# EAGLE design Analog_amplifer_2 (EAGLE 9.6.2)

## Sheet 1 of 2
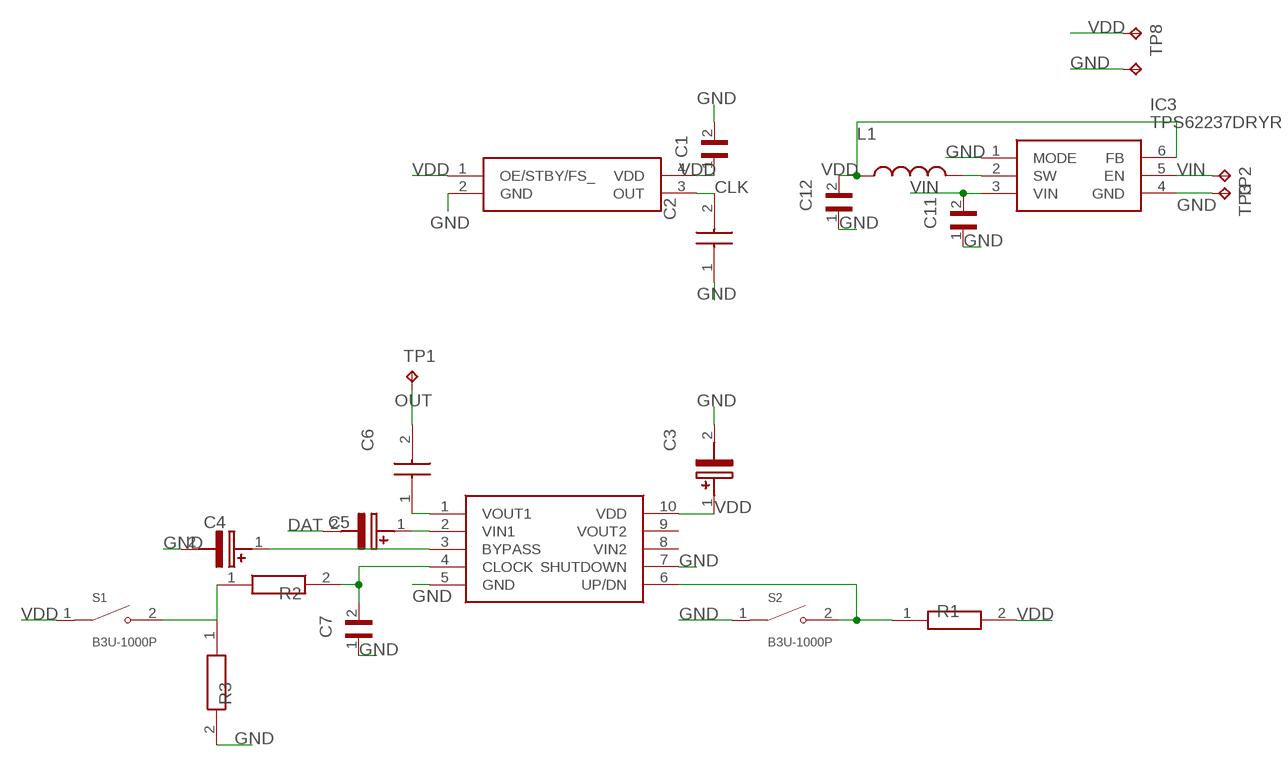
[diagram p0: schematic, sheet 1]

### Parts
C1  GRM033C80J104KE15D  [CAPC0603X33N]
C2  GRM0115C1E5R0CE01L  [CAPC0201X14N]
C3  F380J105MUA  [CAPPC1106X60N]
C4  F380J105MUA  [CAPPC1106X60N]
C5  F380J105MUA  [CAPPC1106X60N]
C6  GRM21BR60J107ME15L  [CAPC2012X145N]
C7  GRM033C80J104KE15D  [CAPC0603X33N]
C11  GRM155R60J225KE95D  [CAPC1005X55N]
C12  GRM155R60J475ME47D  [CAPC1005X60N]
IC1  LM4811MM_NOPB  [SOP50P490X110-10N]
IC3  TPS62237DRYR  [SON50P100X145X60-6N]
L1  LQM21PN2R2MC0D  [INDC2012X55N]
R1  RC0201FR-074K02L  [RESC0603X26N]
R2  RC0201FR-07100RL  [RESC0603X26N]
R3  RC0201FR-07100RL  [RESC0603X26N]
S1  B3U-1000P  [SW_B3U-1000P]
S2  B3U-1000P  [SW_B3U-1000P]
TP1  TPTP11R  [TP11R]
TP2  TPTP11R  [TP11R]
TP3  TPTP11R  [TP11R]
TP4  TPTP11R  [TP11R]
TP8  TPTP11R  [TP11R]
Y1  DSC6053CE2A-003.0720  [DSC6053CE2A0030720]

### Nets
CLK: C2.2 Y1.3(OUT) ; also sheet 2
DAT: C5.2(-) ; also sheet 2
GND: C1.2 C2.1 C3.2(-) C4.2(-) C7.1 C11.1 C12.1 IC1.5(GND) IC1.7(SHUTDOWN) IC3.1(MODE) IC3.4(GND) R3.2 S2.1 TP3.TP TP4.TP Y1.2(GND) ; also sheet 2
N$1: C4.1(+) IC1.3(BYPASS)
N$2: IC3.2(SW) L1.2
N$3: C6.1 IC1.1(VOUT1)
N$4: C7.2 IC1.4(CLOCK) R2.2
N$5: C5.1(+) IC1.2(VIN1)
N$6: IC1.6(UP/DN) R1.1 S2.2
N$7: R2.1 R3.1 S1.2
OUT: C6.2 TP1.TP
VDD: C1.1 C3.1(+) C12.2 IC1.10(VDD) IC3.6(FB) L1.1 R1.2 S1.1 TP8.TP Y1.1(OE/STBY/FS_) Y1.4(VDD) ; also sheet 2
VIN: C11.2 IC3.3(VIN) IC3.5(EN) TP2.TP
Unconnected: IC1.8(VIN2) IC1.9(VOUT2)

## Sheet 2 of 2
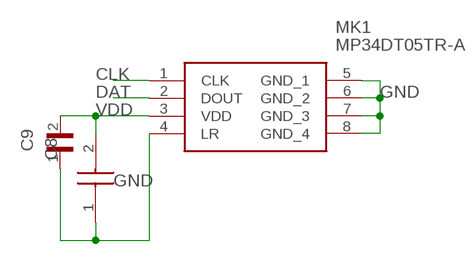
[diagram p1: schematic, sheet 2]

### Parts
C8  C0402C105K9PACTU  [CAPC1005X55N]
C9  GRM033C80J104KE15D  [CAPC0603X33N]
MK1  MP34DT05TR-A  [MP34DT05TRA]

### Nets
CLK: MK1.1(CLK) ; also sheet 1
DAT: MK1.2(DOUT) ; also sheet 1
GND: C8.1 C9.1 MK1.4(LR) MK1.5(GND_1) MK1.6(GND_2) MK1.7(GND_3) MK1.8(GND_4) ; also sheet 1
VDD: C8.2 C9.2 MK1.3(VDD) ; also sheet 1

## Library data of the parts
C1 C7 C9 = GRM033C80J104KE15D:GRM033C80J104KE15D: .1UF 6.3V 10% 0201; DESCRIPTION: SMD Capacitor X6S(EIA) with Capacitance: 0.10uF Tol. 10%. Rated Voltage: 6.3Vdc; DIGI-KEY_PART_NUMBER: 490-10390-1-ND; DIGIKEY-PURCHASE-URL: https://snapeda.com/shop?store=DigiKey&id=1836969; MF: Murata Electronics; MP: GRM033C80J104KE15D; PACKAGE: 0603 Taiyo Yuden
C2 = GRM0115C1E5R0CE01L:GRM0115C1E5R0CE01L: Capacitor GRM01 L=0.25mm W=0.125mm T=0.125mm Source: Datasheet <https://psearch.en.murata.com/capacitor/product/GRM0115C1E5R0CE01#.html>; ARROW_PART_NUMBER: GRM0115C1E5R0CE01L; DESCRIPTION: Capacitor GRM01 L=0.25mm W=0.125mm T=0.125mm; HEIGHT: 0.138mm; MANUFACTURER_NAME: Murata Electronics; MANUFACTURER_PART_NUMBER: GRM0115C1E5R0CE01L; MOUSER_PART_NUMBER: 81-GRM0115C1E5RCE01L; MOUSER_PRICE-STOCK: https://www.mouser.com/Search/Refine.aspx?Keyword=81-GRM0115C1E5RCE01L
C3-C5 = F380J105MUA:F380J105MUA: Tantalum Capacitors - Polymer SMD 1uF, 6.3VDC, 20% TOL 1500mOhm,0402 Source: Datasheet <https://eu.mouser.com/datasheet/2/40/f38-775706.pdf>; ARROW_PART_NUMBER: F380J105MUA; ARROW_PRICE-STOCK: https://www.arrow.com/en/products/f380j105mua/avx; DESCRIPTION: Tantalum Capacitors - Polymer SMD 1uF, 6.3VDC, 20% TOL 1500mOhm,0402; HEIGHT: 0.6mm; MANUFACTURER_NAME: AVX; MANUFACTURER_PART_NUMBER: F380J105MUA; MOUSER_PART_NUMBER: 581-F380J105MUA; MOUSER_PRICE-STOCK: https://www.mouser.com/Search/Refine.aspx?Keyword=581-F380J105MUA
C6 = GRM21BR60J107ME15L:GRM21BR60J107ME15L: Multilayer Ceramic Capacitors MLCC - SMD/SMT 100UF 6.3V 20% 0805 Source: Datasheet <https://psearch.en.murata.com/capacitor/product/GRM21BR60J107ME15#.html>; ARROW_PART_NUMBER: GRM21BR60J107ME15L; ARROW_PRICE-STOCK: https://www.arrow.com/en/products/grm21br60j107me15l/murata-manufacturing; DESCRIPTION: Multilayer Ceramic Capacitors MLCC - SMD/SMT 100UF 6.3V 20% 0805; HEIGHT: 1.45mm; MANUFACTURER_NAME: Murata Electronics; MANUFACTURER_PART_NUMBER: GRM21BR60J107ME15L; MOUSER_PART_NUMBER: 81-GRM21BR60J107ME5L; MOUSER_PRICE-STOCK: https://www.mouser.co.uk/ProductDetail/Murata-Electronics/GRM21BR60J107ME15L?qs=qSv5qXjCIG0V4cgMTBuIkA%3D%3D
C8 = C0402C105K9PACTU:C0402C105K9PACTU: 0402 X5R ceramic capacitor, 6.3V 1uF Kemet 0402 C 1uF Ceramic Multilayer Capacitor, 6.3 V dc, +85C, X5R Dielectric, +/-10% Source: Datasheet <https://content.kemet.com/datasheets/KEM_C1002_X7R_SMD.pdf>; ARROW_PART_NUMBER: C0402C105K9PACTU; ARROW_PRICE-STOCK: https://www.arrow.com/en/products/c0402c105k9pactu/kemet-corporation; DESCRIPTION: 0402 X5R ceramic capacitor, 6.3V 1uF Kemet 0402 C 1uF Ceramic Multilayer Capacitor, 6.3 V dc, +85C, X5R Dielectric, +/-10%; HEIGHT: 0.55mm; MANUFACTURER_NAME: Kemet; MANUFACTURER_PART_NUMBER: C0402C105K9PACTU; MOUSER_PART_NUMBER: 80-C0402C105K9P; MOUSER_PRICE-STOCK: https://www.mouser.co.uk/ProductDetail/KEMET/C0402C105K9PACTU?qs=UdQET6xYxVCMExqTDkuPeQ%3D%3D
C11 = GRM155R60J225KE95D:GRM155R60J225KE95D: CAP CER 2.2UF 6.3V X5R 0402; DESCRIPTION: 2.2µF ±10% 6.3V Ceramic Capacitor X5R 0402 (1005 Metric); DIGI-KEY_PART_NUMBER: 490-12532-1-ND; MF: Murata; MP: GRM155R60J225KE95D; PACKAGE: 1005 Taiyo Yuden
C12 = GRM155R60J475ME47D:GRM155R60J475ME47D: Cap Ceramic 4.7uF 6.3V X5R 20% Pad SMD 0402 85°C T/R; DESCRIPTION: SMD Capacitor X5R(EIA) with Capacitance: 4.7uF Tol. 20%. Rated Voltage: 6.3Vdc; DIGI-KEY_PART_NUMBER: 490-5915-1-ND; MF: Murata; MP: GRM155R60J475ME47D; PACKAGE: 1005 Taiyo Yuden
IC1 = LM4811MM_NOPB:LM4811MM_NOPB: LM4811 Dual 105mW Headphone Amplifier with Digital Volume Control and Shutdown Mode Source: Datasheet <http://www.ti.com/lit/ds/symlink/lm4811.pdf>; ARROW_PART_NUMBER: LM4811MM/NOPB; ARROW_PRICE-STOCK: https://www.arrow.com/en/products/lm4811mmnopb/texas-instruments; DESCRIPTION: LM4811 Dual 105mW Headphone Amplifier with Digital Volume Control and Shutdown Mode; HEIGHT: 1.1mm; MANUFACTURER_NAME: Texas Instruments; MANUFACTURER_PART_NUMBER: LM4811MM/NOPB; MOUSER_PART_NUMBER: 926-LM4811MM/NOPB; MOUSER_PRICE-STOCK: https://www.mouser.co.uk/ProductDetail/Texas-Instruments/LM4811MM-NOPB?qs=QbsRYf82W3FLuQL5YsjYUw%3D%3D
IC3 = TPS62237DRYR:TPS62237DRYR: 2 MHz Ultra Small Step Down Converter with DCS-Control in 1x1.5 SON Package Source: Datasheet <http://www.ti.com/lit/gpn/TPS62230>; ARROW_PART_NUMBER: TPS62237DRYR; ARROW_PRICE-STOCK: https://www.arrow.com/en/products/tps62237dryr/texas-instruments; DESCRIPTION: 2 MHz Ultra Small Step Down Converter with DCS-Control in 1x1.5 SON Package; HEIGHT: 0.6mm; MANUFACTURER_NAME: Texas Instruments; MANUFACTURER_PART_NUMBER: TPS62237DRYR; MOUSER_PART_NUMBER: 595-TPS62237DRYR; MOUSER_PRICE-STOCK: https://www.mouser.co.uk/ProductDetail/Texas-Instruments/TPS62237DRYR?qs=%2Fqzd9s%252BcLd6Amw0z%252Byi3sQ%3D%3D
L1 = LQM21PN2R2MC0D:LQM21PN2R2MC0D: INDUCTOR, 2.2UH, 20%, 0.6A, 50MHZ, 0805; DESCRIPTION: Inductor with Inductance: 2.2uH Tol. +/-20%, Package: 0805 (2012); DIGI-KEY_PART_NUMBER: 490-4994-1-ND; DIGIKEY-PURCHASE-URL: https://snapeda.com/shop?store=DigiKey&id=1501934; MF: Murata; MOUSER-PURCHASE-URL: https://snapeda.com/shop?store=Mouser&id=1501934; MP: LQM21PN2R2MC0D; PACKAGE: 2012 Murata
MK1 = MP34DT05TR-A:MP34DT05TR-A: STMICROELECTRONICS - MP34DT05TR-A - MEMS MICROPHONE, 3.6V, HCLGA-4 Source: Datasheet <http://www.st.com/content/ccc/resource/technical/document/datasheet/group3/c7/90/d3/f6/b7/e7/40/c8/DM00415595/files/DM00415595.pdf/jcr:content/translations/en.DM00415595.pdf>; DESCRIPTION: STMICROELECTRONICS - MP34DT05TR-A - MEMS MICROPHONE, 3.6V, HCLGA-4; HEIGHT: 1mm; MANUFACTURER_NAME: STMicroelectronics; MANUFACTURER_PART_NUMBER: MP34DT05TR-A; MOUSER_PART_NUMBER: 511-MP34DT05TR-A; MOUSER_PRICE-STOCK: https://www.mouser.com/Search/Refine.aspx?Keyword=511-MP34DT05TR-A
R1 = RC0201FR-074K02L:RC0201FR-074K02L: YAGEO RC0201 F Source: Datasheet <http://www.yageo.com/documents/recent/PYu-RC0201_51_RoHS_L_8.pdf>; ARROW_PART_NUMBER: RC0201FR-074K02L; DESCRIPTION: YAGEO RC0201 F; HEIGHT: 0.26mm; MANUFACTURER_NAME: YAGEO (PHYCOMP); MANUFACTURER_PART_NUMBER: RC0201FR-074K02L
R2 R3 = RC0201FR-07100RL:RC0201FR-07100RL: Thick Film Resistors - SMD 100 OHM 1% Source: Datasheet <http://www.yageo.com/documents/recent/PYu-RC0201_51_RoHS_L_8.pdf>; ARROW_PART_NUMBER: RC0201FR-07100RL; DESCRIPTION: Thick Film Resistors - SMD 100 OHM 1%; HEIGHT: 0.26mm; MANUFACTURER_NAME: YAGEO (PHYCOMP); MANUFACTURER_PART_NUMBER: RC0201FR-07100RL; MOUSER_PART_NUMBER: 603-RC0201FR-07100RL; MOUSER_PRICE-STOCK: https://www.mouser.com/Search/Refine.aspx?Keyword=603-RC0201FR-07100RL
S1 S2 = B3U-1000P:B3U-1000P: Switch Tactile N.O. SPST Round Button Gull Wing 0.05A 12VDC 1.5N SMD Embossed T/R; DESCRIPTION: Tactile Switch SPST-NO Top Actuated Surface Mount; DIGI-KEY_PART_NUMBER: SW1020CT-ND; DIGIKEY-PURCHASE-URL: https://snapeda.com/shop?store=DigiKey&id=104326; MF: Omron; MP: B3U-1000P; PACKAGE: None
TP1-TP4 TP8 = testpad:TP: Test pad
Y1 = DSC6053CE2A-003.0720:DSC6053CE2A-003.0720: Programmable Oscillators MEMS Oscillator, Ultra Low Power, LVCMOS, -20C-70C, 25ppm, 3.2x2.5mm Source: Datasheet; DESCRIPTION: Programmable Oscillators MEMS Oscillator, Ultra Low Power, LVCMOS, -20C-70C, 25ppm, 3.2x2.5mm; HEIGHT: 0.9mm; MANUFACTURER_NAME: Microchip; MANUFACTURER_PART_NUMBER: DSC6053CE2A-003.0720

## Board
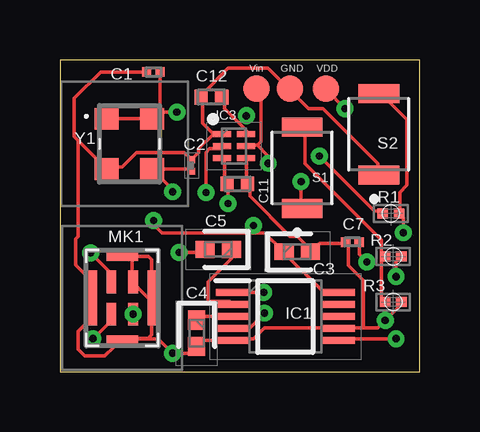
[diagram p2: board, top side]
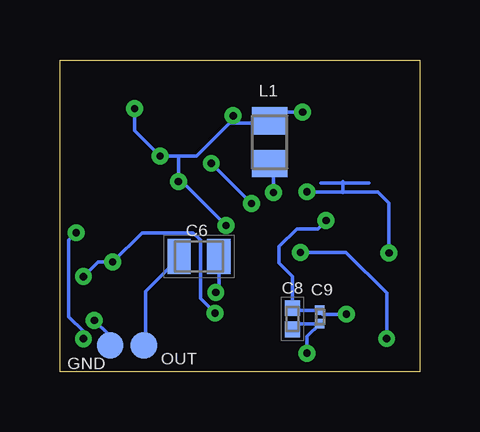
[diagram p3: board, bottom side, seen from below]

Size 15 x 13 mm. Coordinates in mm from the lower left corner, seen from the top.
Outline: 0,0 15,0 15,13 0,13 0,0
Copper layers (1*16): Top 0.035mm / dielectric 1.5mm / Bottom 0.035mm
Design rules "default *": minimum track width 6mil, minimum drill 0.3mm, track to track 6mil, track to pad 6mil, pad to pad 6mil, via to via 6mil, smd to smd 6mil, copper to edge 10mil, drill to drill 0.3mm, minimum pad ring 10mil, minimum via ring 8mil, stop-mask expansion 4mil, vias tented up to drill 0mil, thermal gap 10mil

### Footprints (pad centres in the part's own frame; a part is rotated, then mirrored left to right if it is on the bottom)
CAPC0603X33N = smd 0.38 x 0.4: 1 -0.281,0; 2 0.281,0
CAPC0201X14N = smd 0.29 x 0.26: 1 -0.245,0; 2 0.245,0
CAPPC1106X60N = smd 0.8 x 0.7: 1 -0.55,0; 2 0.55,0
CAPC2012X145N = smd 0.97 x 1.47: 1 -0.83,0; 2 0.83,0
CAPC1005X55N = smd 0.65 x 0.62: 1 -0.44,0; 2 0.44,0
CAPC1005X55N' = smd 0.54 x 0.6: 1 -0.432,0; 2 0.432,0
CAPC1005X60N = smd 0.56 x 0.63: 1 -0.435,0; 2 0.435,0
SOP50P490X110-10N = smd 1.4 x 0.3: 1 -2.2,1; 2 -2.2,0.5; 3 -2.2,0; 4 -2.2,-0.5; 5 -2.2,-1; 6 2.2,-1; 7 2.2,-0.5; 8 2.2,0; 9 2.2,0.5; 10 2.2,1
SON50P100X145X60-6N = smd 0.75 x 0.25: 1 -0.5,0.5; 2 -0.5,0; 3 -0.5,-0.5; 4 0.5,-0.5; 5 0.5,0; 6 0.5,0.5
INDC2012X55N = smd 1.14 x 1.47: 1 -0.89,0; 2 0.89,0
MP34DT05TRA = smd 0.4 x 0.95: 1 -0.45,0.675; 2 -0.45,-0.675; 3 0.45,-0.675; 4 0.45,0.675 | smd 0.35 x 2.3: 5 -1.225,0; 6 1.225,0 | smd 1.3 x 0.35: 7 0,1.725; 8 0,-1.725
RESC0603X26N = smd 0.44 x 0.42: 1 -0.34,0; 2 0.34,0
SW_B3U-1000P = smd 0.8 x 1.7: 1 -1.7,0; 2 1.7,0
TP11R = smd 1.1 x 1.1: TP 0,0
DSC6053CE2A0030720 = smd 1 x 0.9: 1 -0.95,1.05; 2 -0.95,-1.05; 3 0.95,-1.05; 4 0.95,1.05

### Placement (x,y rotation side)
C1  3.9,12.5 180 top
C2  5.5,8.6 270 top
C3  9.9,5 0 top
C4  5.7,1.6 270 top
C5  6.6,5.1 180 top
C6  9.2,4.8 180 bottom
C7  12.2,5.4 0 top
C8  5.3,2.2 90 bottom
C9  4.16,2.28 90 bottom
C11  GRM155R60J225KE95D  [CAPC1005X55N']  7.4,7.84 180 top
C12  6.32,11.45 0 top
IC1  9.4,2.3 0 top
IC3  7.25,9.41 0 top
L1  6.25,9.57 270 bottom
MK1  2.6,3.07 0 top
R1  13.8,6.6 180 top
R2  13.9,4.8 0 top
R3  13.9,2.9 0 top
S1  10.1,8.5 90 top
S2  13.3,9.9 90 top
TP1  11.5,1.1 0 bottom
TP2  8.2,11.8 0 top
TP3  12.9,1.1 0 bottom
TP4  9.6,11.8 0 top
TP8  11.1,11.8 0 top
Y1  2.9,9.5 0 top

### Tracks (layer width: path | path; a pad name or v marks a point on that pad's centre or on a via)
CLK  (via drill 0.3)
  Top 0.152: v1.27,4.95 2.12,4.1 2.12,3.75 MK1.1 | v4.7,7.5 4.7,7.6 Y1.3 5.41,8.45 C2.2
  Bottom 0.152: 2.12,7.88 3.2,7.88 | 3.2,7.88 4.12,7.88 | v1.27,4.95 1.27,7.03 1.75,7.5 3.2,7.5 | v4.7,7.5 3.2,7.5 | 3.2,7.5 3.2,7.88 | 3.2,7.92 3.2,7.88 | 3.2,7.47 3.2,7.5
DAT  (via drill 0.3)
  Top 0.152: v4.97,4.97 5.75,4.97 5.88,5.1 C5.2 | v1.38,1.38 2.12,2.12 2.12,2.38 MK1.2
  Bottom 0.152: v1.38,1.38 1.38,3.27 3.08,4.97 v4.97,4.97
GND  (via drill 0.3)
  Top 0.152: 7.75,7.92 C11.1 | MK1.4 3.12,3.62 3.75,3 MK1.6 | MK1.7 2.85,4.79 3,4.65 3,4.12 | 3,4.12 3,3.75 MK1.4 | MK1.7 2.6,4.76 2.53,4.72 | 3,4.12 MK1.4 | 2.62,4.88 MK1.7 | 7.75,7.78 C11.1 | 6.75,10.03 IC3.1 | 2.62,1.28 MK1.8 1.87,0.65 1.02,0.65 0.75,0.93 0.75,1.68 1.38,2.3 MK1.5 1.38,3.73 0.65,4.45 0.65,5.53 0.76,5.64 0.76,9.64 | 2.62,1.28 2.59,1.38 3.68,1.38 3.83,1.52 MK1.6 | 2.62,1.28 2.64,1.18 2.83,1.37 4.1,1.37 v4.7,0.77 5.79,0.77 5.49,1.07 5.64,1.07 | 5.95,11.45 C12.1 | C1.2 1.7,12.5 0.6,11.4 0.6,9.8 0.76,9.64 | 0.76,9.64 Y1.2 1.98,8.53 2.59,8.53 3.2,9.14 5.18,9.14 5.49,8.84 | 12.65,1.83 11.73,1.83 IC1.7 11.58,1.83 8.53,1.83 8.08,1.37 7.32,1.37 IC1.5 5.95,1.3 C4.2 5.64,1.07 | 12.65,1.83 13.26,1.83 v13.56,2.13 14.17,2.74 14.17,2.9 R3.2 | C11.1 7.77,7.92 7.77,8.84 IC3.4 | 10.52,5.03 10.82,5.33 11.89,5.33 C7.1 12.04,5.33 12.04,4.42 12.65,3.81 12.65,1.83 | 10.52,5.03 9.91,5.64 9.6,5.64 7.92,7.32 7.92,7.77 C11.1 | 10.52,5.03 C3.2 | 5.64,1.07 5.86,1.07 5.78,1.15 | 5.49,8.84 5.79,9.14 5.79,9.3 6.4,9.91 | 6.4,9.91 6.71,9.91 IC3.1 | 6.4,9.91 5.94,10.36 5.94,11.43 C12.1 | 6.4,9.91 IC3.1 | C12.1 5.94,11.58 7.01,12.65 8.69,12.65 9.45,11.89 TP4.TP 9.6,11.73 10.36,10.97 10.97,10.97 13.26,8.69 13.26,8.23 S2.1 | 5.49,8.84 C2.1 | MK1.7 3.71,4.79 3.83,4.67 MK1.6
  Bottom 0.152: 12.9,1.48 TP3.TP 12.95,1.52 v13.56,2.13 | C8.1 5.06,2 C9.1 4.7,1.46 v4.7,0.77
N$1
  Top 0.152: IC1.3 5.85,2.3 C4.1
N$2  (via drill 0.3)
  Top 0.152: 6.75,9.53 IC3.2 6.71,9.3 6.25,9.3 6.1,9.14 v6.1,7.47
  Bottom 0.152: v6.1,7.47 6.1,8.38 6.25,8.53 L1.2
N$3  (via drill 0.3)
  Top 0.152: IC1.1 v8.5,3.3
  Bottom 0.152: v8.5,3.3 8.37,3.43 C6.1
N$4  (via drill 0.3)
  Top 0.152: v12.8,4.57 12.5,4.88 12.5,5.33 C7.2 | v14.02,3.96 14.02,4.57 14.17,4.72 R2.2 | v8.53,2.44 7.92,1.83 7.32,1.83 IC1.4
  Bottom 0.152: v14.02,3.96 13.41,4.57 v12.8,4.57 11.58,5.79 9.45,5.79 9.14,5.49 9.14,3.05 v8.53,2.44
N$5
  Top 0.152: C5.1 7.15,4.72 6.17,3.75 6.17,2.96 6.21,2.92 7.08,2.92 IC1.2
N$6  (via drill 0.3)
  Top 0.152: S2.2 13.41,11.58 14.48,10.52 14.48,7.77 14.17,7.47 14.17,6.71 R1.1 14.17,6.55 14.33,6.4 v14.33,5.79 | v14.02,1.37 11.73,1.37 IC1.6
  Bottom 0.152: v14.02,1.37 14.02,1.68 14.63,2.29 14.63,5.49 v14.33,5.79
N$7
  Top 0.152: R3.1 13.41,3.05 13.41,4.72 R2.1 13.41,4.88 13.41,5.49 10.21,8.69 10.21,10.06 S1.2
OUT
  Bottom 0.152: TP1.TP 11.43,1.22 11.43,3.35 10.06,4.72 C6.2
VDD  (via drill 0.3)
  Top 0.152: 3.08,2.05 3.08,2.39 v3.05,2.4 | IC3.6 7.75,10.03 7.77,10.06 7.47,10.36 | Y1.4 4.18,10.88 C1.1 | Y1.4 Y1.1 | IC1.10 11,3.3 9.35,4.95 C3.1 9.3,5.03 8.53,5.79 8.08,5.79 | 8.08,5.79 4.25,5.79 3.9,6.14 v3.9,6.3 | 7.47,10.36 6.86,10.97 6.86,11.43 C12.2 | v10.82,8.99 13.11,6.71 13.41,6.71 R1.2 | v11.89,10.97 11.12,11.73 TP8.TP | v7.77,10.67 7.47,10.36 | v10.06,7.92 10.06,6.86 S1.1 | v4.88,10.82 4.12,10.82 Y1.4 | v8.08,6.1 8.08,5.79
  Bottom 0.152: 10.06,8.99 9.3,8.99 7.92,10.36 7.77,10.36 | 10.06,8.99 v10.82,8.99 11.89,10.06 v11.89,10.97 | 7.77,10.36 6.4,10.36 L1.1 6.25,10.52 5.94,10.82 v4.88,10.82 | 7.77,10.36 v7.77,10.67 | 10.06,8.99 10.06,8.08 | 10.06,8.08 v8.08,6.1 | 10.06,8.08 v10.06,7.92 | v3.05,2.4 4.04,2.4 4.16,2.51 C9.2 5.22,2.56 C8.2 5.3,3.98 5.86,4.53 5.86,5.22 5.12,5.96 4.24,5.96 v3.9,6.3
VIN  (via drill 0.3)
  Top 0.152: IC3.5 7.77,9.45 8.23,9.45 | IC3.3 6.86,8.84 6.86,7.92 C11.2 7.01,7.77 v7.01,7.01 | 8.23,9.45 8.38,9.6 8.38,11.58 8.23,11.73 TP2.TP | v8.69,8.69 8.69,8.99 8.23,9.45
  Bottom 0.152: v8.69,8.69 v7.01,7.01

### Text on the board
tNames: Vin | GND | VDD | Y1 | IC3 | MK1 | IC1
bNames: OUT | GND